# EAGLE design SolarMPPT (EAGLE 9.6.0)
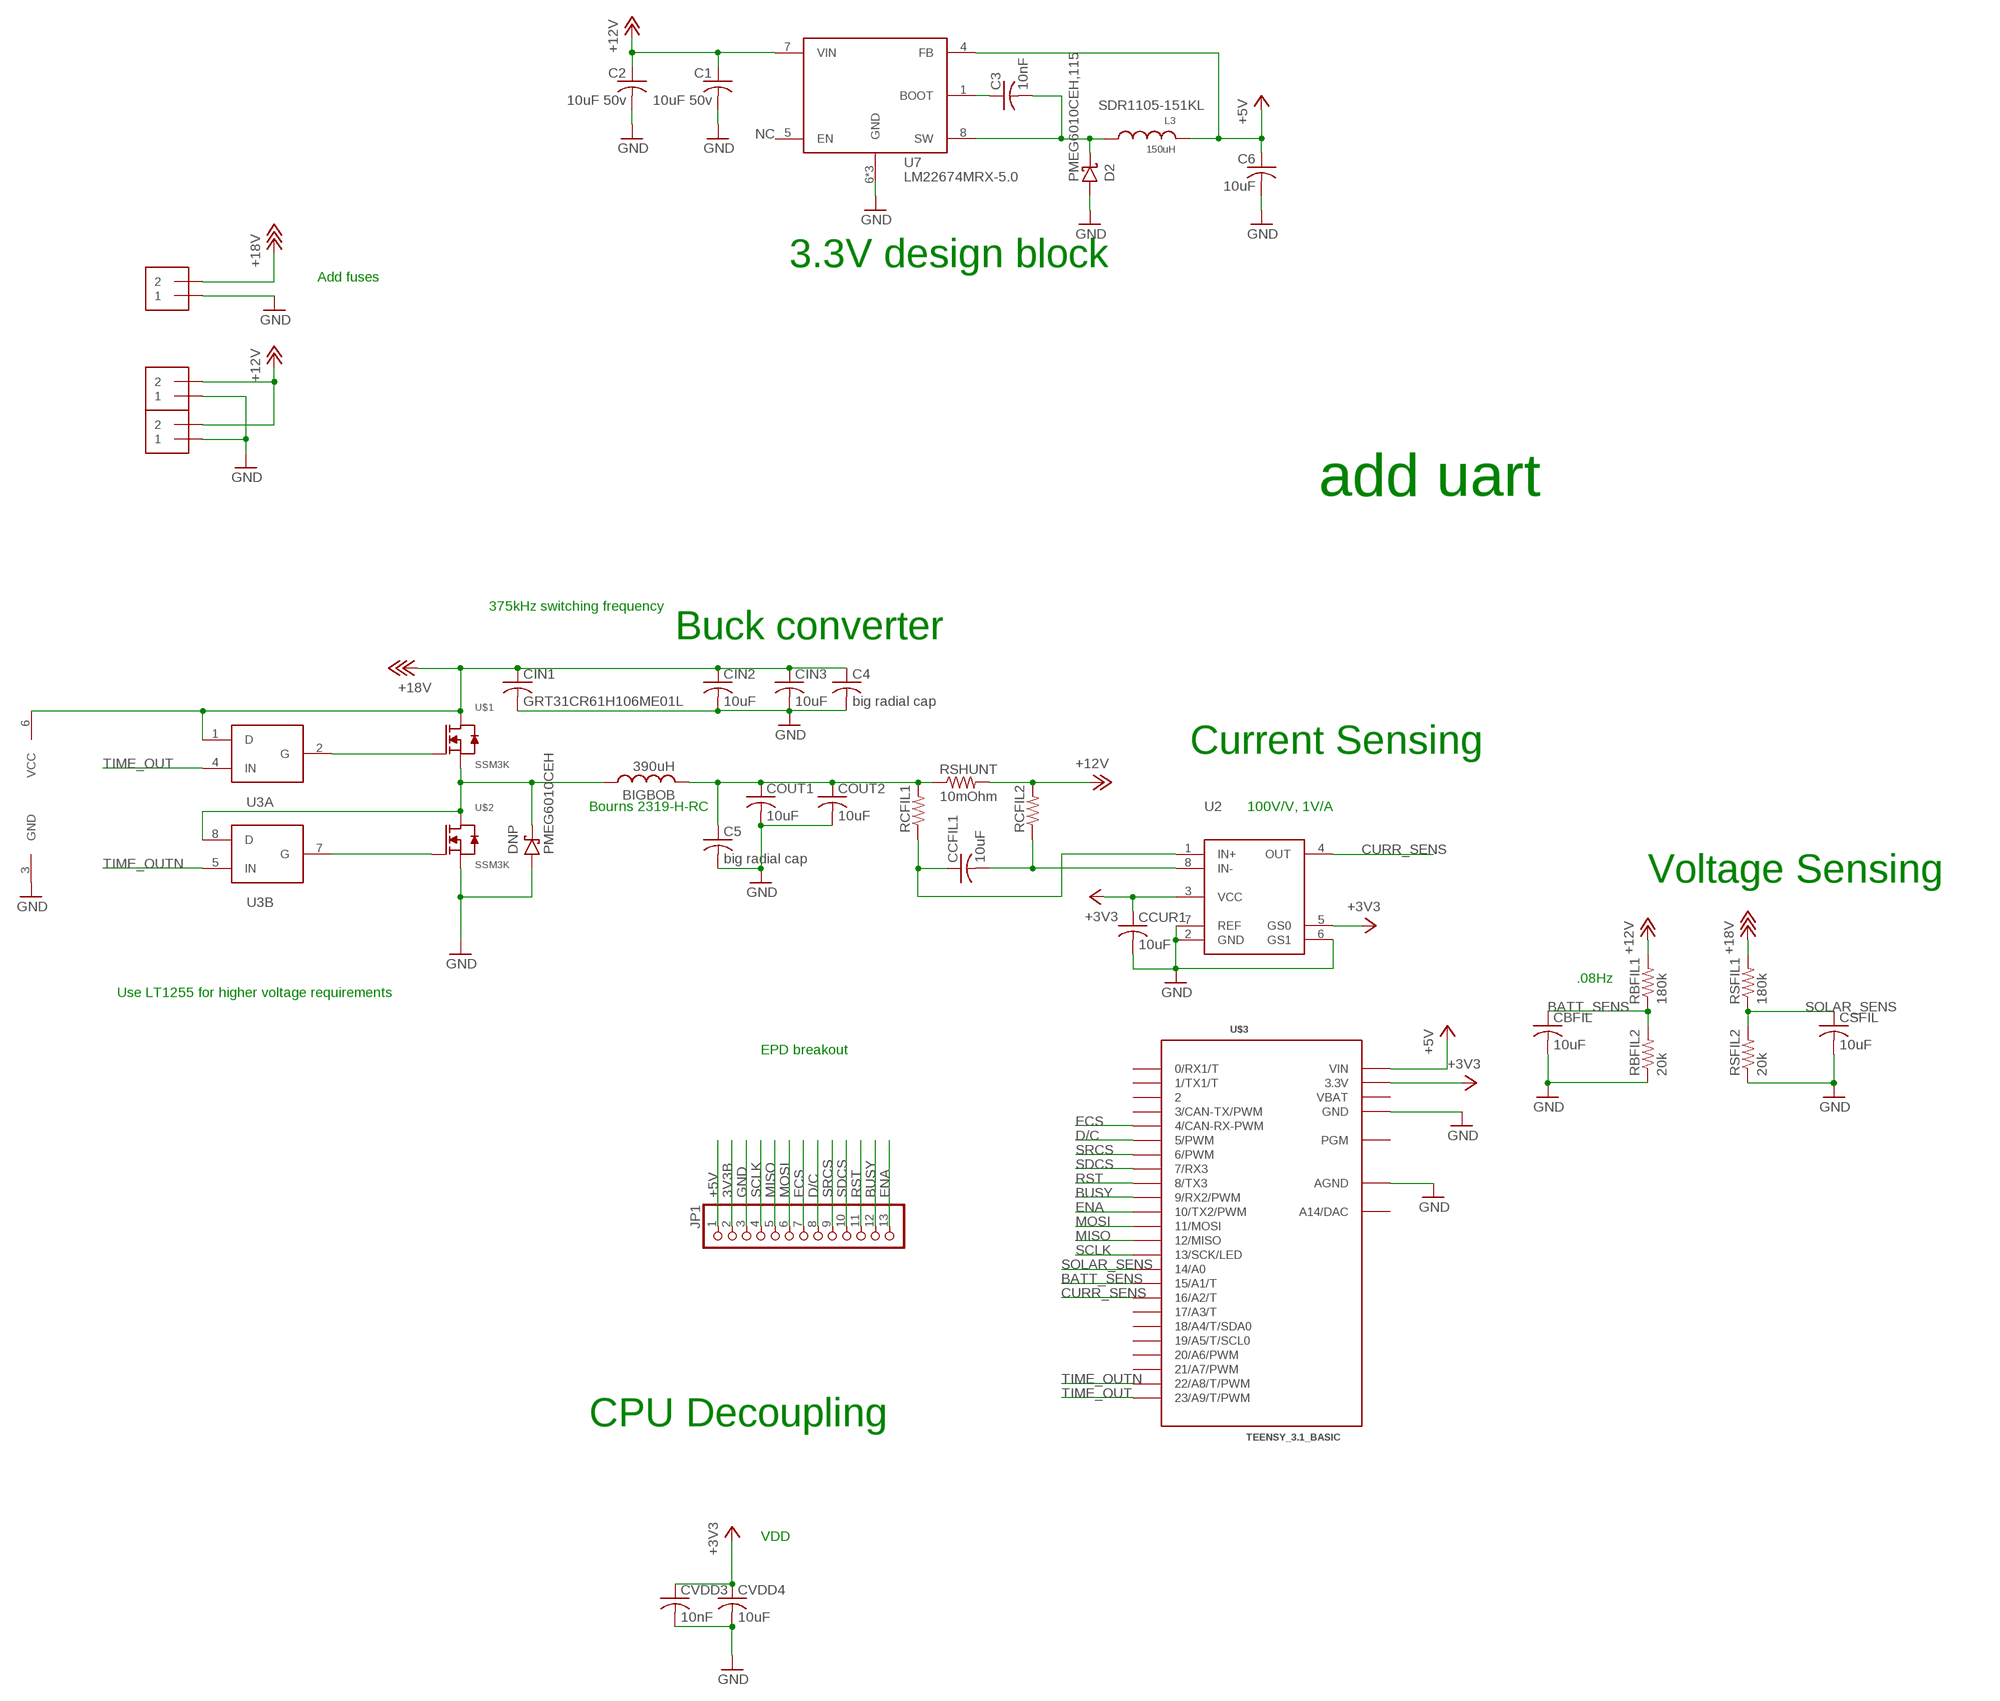
[diagram p0: schematic, sheet 1]

## Parts
BIGBOB  390uH  L-USTJ6-U2  [TJ6-U2]
C1  10uF 50v  C-USC0805  [C0805]
C2  10uF 50v  C-USC1206  [C1206]
C3  10nF  C-USC0805  [C0805]
C4  big radial cap  C-US050-024X044  [C050-024X044]
C5  big radial cap  C-US050-024X044  [C050-024X044]
C6  10uF  C-USC0805  [C0805]
CBFIL  10uF  C-USC0805  [C0805]
CCFIL1  10uF  C-USC0805  [C0805]
CCUR1  10uF  C-USC0805  [C0805]
CIN1  GRT31CR61H106ME01L  C-USC1206  [C1206]
CIN2  10uF  C-USC1206  [C1206]
CIN3  10uF  C-USC1206  [C1206]
COUT1  10uF  C-USC1206  [C1206]
COUT2  10uF  C-USC1206  [C1206]
CSFIL  10uF  C-USC0805  [C0805]
CVDD3  10nF  C-USC0805  [C0805]
CVDD4  10uF  C-USC0805  [C0805]
D2  PMEG6010CEH,115  [SOD-123]
DNP  PMEG6010CEH  MBR0520LT3G  [SOD-123]
J2  1X2-3.5MM  [1X2-3.5MM]
J3  1X2-3.5MM  [1X2-3.5MM]
J6  1X2-3.5MM  [1X2-3.5MM]
JP1  PINHD-1X13  [1X13]
L3  150uH  SDR1105  [SDR1105]
RBFIL1  180k  R-US_R0805  [R0805]
RBFIL2  20k  R-US_R0805  [R0805]
RCFIL1  R-US_R0805  [R0805]
RCFIL2  R-US_R0805  [R0805]
RSFIL1  180k  R-US_R0805  [R0805]
RSFIL2  20k  R-US_R0805  [R0805]
RSHUNT  10mOhm  R-US_R1206  [R1206]
U2  INA225VSSOP  [VSSOP-8]
U3  LTC1155  [LT-SOL8]
U7  LM22674MRX-5.0  LM22674  [SOIC-8-POWERPAD]
U$1  SSM3K  [SOT-23-MOSFET]
U$2  SSM3K  [SOT-23-MOSFET]
U$3  TEENSY_3.1_BASIC  [TEENSY_3.1_BASIC]

## Nets
3V3B: JP1.2
+3V3: CCUR1.1 CVDD3.1 CVDD4.1 U2.3(VCC) U2.5(GS0) U$3.3.3V U$3.3.3V1(3.3V)
+5V: C6.1 JP1.1 L3.P$1 U7.4(FB) U$3.VIN
+12V: C1.1 C2.1 J2.2 J3.2 RBFIL1.2 RCFIL2.2 RSHUNT.2 U7.7(VIN)
+18V: C4.1 CIN1.1 CIN2.1 CIN3.1 J6.2 RSFIL1.2 U3.1(A:D) U3.6(P:VCC) U$1.D
BATT_SENS: CBFIL.1 RBFIL1.1 RBFIL2.2 U$3.15/A1(15/A1/T)
BOOT_5V2: C3.1 U7.1(BOOT)
BUSY: JP1.12 U$3.9(9/RX2/PWM)
CURR_SENS: U2.4(OUT) U$3.16/A2(16/A2/T)
D/C: JP1.8 U$3.5(5/PWM)
ECS: JP1.7 U$3.4(4/CAN-RX-PWM)
ENA: JP1.13 U$3.10(10/TX2/PWM)
GND: C1.2 C2.2 C4.2 C5.2 C6.2 CBFIL.2 CCUR1.2 CIN1.2 CIN2.2 CIN3.2 COUT1.2 COUT2.2 CSFIL.2 CVDD3.2 CVDD4.2 D2.A DNP.A J2.1 J3.1 J6.1 JP1.3 RBFIL2.1 RSFIL2.1 U2.2(GND) U2.6(GS1) U2.7(REF) U3.3(P:GND) U7.6(GND) U7.PAD1(GND) U7.PAD(GND) U$2.S U$3.AGND U$3.GND U$3.GND1(GND)
MISO: JP1.5 U$3.12(12/MISO)
MOSI: JP1.6 U$3.11(11/MOSI)
N$4: U3.2(A:G) U$1.G
N$5: CCFIL1.2 RCFIL2.1 U2.8(IN-)
N$6: CCFIL1.1 RCFIL1.1 U2.1(IN+)
N$7: BIGBOB.1 DNP.K U3.8(B:D) U$1.S U$2.D
N$8: U3.7(B:G) U$2.G
N$10: BIGBOB.2 C5.1 COUT1.1 COUT2.1 RCFIL1.2 RSHUNT.1
RST: JP1.11 U$3.8(8/TX3)
SCLK: JP1.4 U$3.13(13/SCK/LED)
SDCS: JP1.10 U$3.7(7/RX3)
SOLAR_SENS: CSFIL.1 RSFIL1.1 RSFIL2.2 U$3.14/A0
SRCS: JP1.9 U$3.6(6/PWM)
SW_5V2: C3.2 D2.K L3.P$2 U7.8(SW)
TIME_OUT: U3.4(A:IN) U$3.23/A9(23/A9/T/PWM)
TIME_OUTN: U3.5(B:IN) U$3.22/A8(22/A8/T/PWM)
Unconnected: U7.5(EN) U$3.0(0/RX1/T) U$3.1(1/TX1/T) U$3.2 U$3.3(3/CAN-TX/PWM) U$3.17/A3(17/A3/T) U$3.18/A4(18/A4/T/SDA0) U$3.19/A5(19/A5/T/SCL0) U$3.20/A6(20/A6/PWM) U$3.21/A7(21/A7/PWM) U$3.A14(A14/DAC) U$3.PGM

## Notes on the sheet
- SDR1105-151KL
- NC
- 3.3V design block
- Add fuses
- add uart
- 375kHz switching frequency
- Buck converter
- Current Sensing
- Bourns 2319-H-RC | 100V/V, 1V/A
- Voltage Sensing
- .08Hz
- Use LT1255 for higher voltage requirements
- EPD breakout
- CPU Decoupling
- VDD

## Power pins joined to a net without a drawn wire
VBAT: U$3.VBAT

## Library data of the parts
BIGBOB = rcl:L-US: INDUCTOR, American symbol; SPICEPREFIX: L
C1 = rcl:C-US: CAPACITOR, American symbol; PARTNO: UMK212BJ105KG-T
C2 = rcl:C-US: CAPACITOR, American symbol; PARTNO: GRM31CR71H475KA12L
C3 = rcl:C-US: CAPACITOR, American symbol; PARTNO: GRM216R71H103KA01D
C4 C5 CBFIL CCFIL1 CCUR1 CIN1-CIN3 COUT1 COUT2 CSFIL CVDD3 CVDD4 = rcl:C-US: CAPACITOR, American symbol; SPICEPREFIX: C
C6 = rcl:C-US: CAPACITOR, American symbol; PARTNO: GRM21BR61E106KA73L
D2 = FormE:PMEG6010CEH,115; PARTNO: PMEG6010CEH115
DNP = FormE:MBR0520LT3G; VALUE: MBR0520LT3G
J2 J3 J6 = adafruit:1X2: 3.5mm Terminal block http://www.ladyada.net/library/pcb/eaglelibrary.html
JP1 = pinhead:PINHD-1X13: PIN HEADER
L3 = FormE:SDR1105; PARTNO: SDR1105-151KL
RBFIL1 RBFIL2 RCFIL1 RCFIL2 RSFIL1 RSFIL2 RSHUNT = rcl:R-US_: RESISTOR, American symbol; SPICEPREFIX: R
U2 = FormE:INA225: Current Shunt Amplifier Link <http://www.ti.com/lit/ds/symlink/ina225-q1.pdf>
U3 = FormE:LTC1155
U7 = FormE:LM22674; PARTNO: LM22674MRX-5.0/NOPB; VALUE: LM22674
U$1 U$2 = FormE:SSM3K: N channel MOSFET SSM3K329RLFCT-ND
U$3 = FormE:TEENSY_3.1_BASIC: Footprint for Teensy 3.1 board using all pin connections on the outer perimeter

## Board
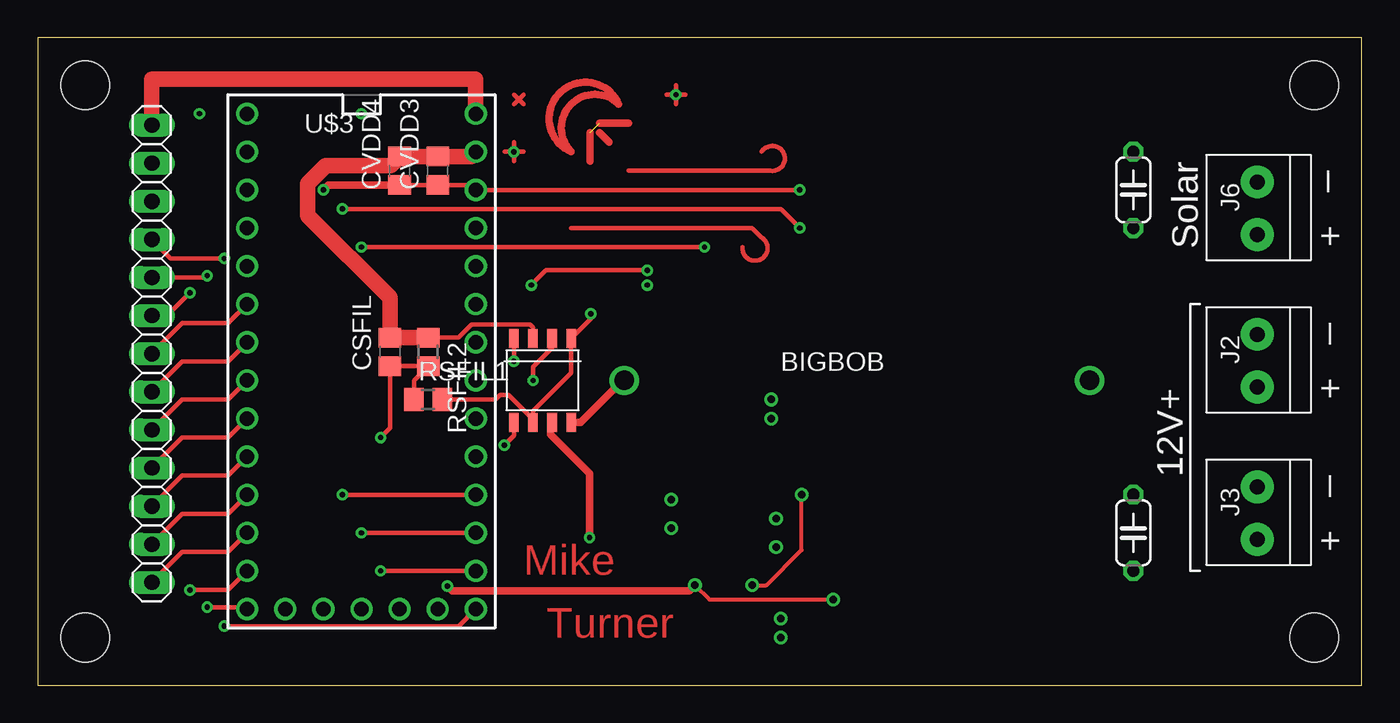
[diagram p1: board, top side]
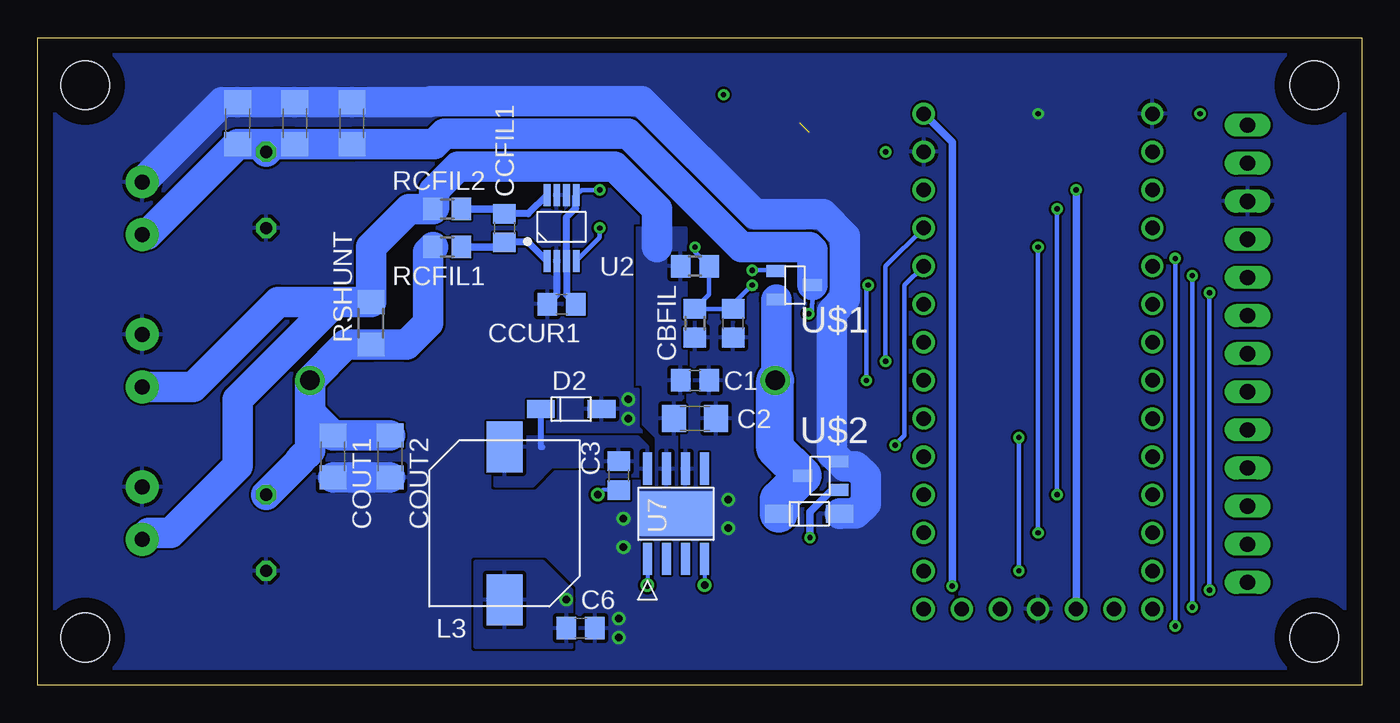
[diagram p2: board, bottom side, seen from below]

Size 88.27 x 43.18 mm. Coordinates in mm from the lower left corner, seen from the top.
Outline: 0,0 88.27,0 88.27,43.18 0,43.18 0,0
Copper layers (1*16): Top 0.035mm / dielectric 1.5mm / Bottom 0.035mm
Design rules "default": minimum track width 6mil, minimum drill 0.35mm, track to track 6mil, track to pad 6mil, pad to pad 6mil, via to via 6mil, smd to smd 6mil, copper to edge 40mil, drill to drill 6mil, minimum pad ring 10mil, minimum via ring 8mil, stop-mask expansion 4mil, vias tented up to drill 0mil, thermal gap 10mil
Holes 3.25 mm at 3.18,3.17 3.18,40.01 85.09,3.17 85.09,40.01

### Footprints (pad centres in the part's own frame; a part is rotated, then mirrored left to right if it is on the bottom)
TJ6-U2 = drill 1.3: 1 -15.5,0; 2 15.5,0
C0805 = smd 1.3 x 1.5: 1 -0.95,0; 2 0.95,0
C1206 = smd 1.6 x 1.8: 1 -1.4,0; 2 1.4,0
C050-024X044 = drill 0.813 octagon: 1 -2.54,0; 2 2.54,0
SOD-123 = smd 1.2 x 1.85: A 0,-2.025; K 0,2.025
1X2-3.5MM = drill 1 pad 2.184: 1 1.8,0; 2 -1.7,0
1X13 = drill 1.016 long: 1 -15.24,0; 2 -12.7,0; 3 -10.16,0; 4 -7.62,0; 5 -5.08,0; 6 -2.54,0; 7 0,0; 8 2.54,0; 9 5.08,0; 10 7.62,0; 11 10.16,0; 12 12.7,0; 13 15.24,0
SDR1105 = smd 2.4 x 3.4: P$1 0,5.1; P$2 0,-5.1
R0805 = smd 1.3 x 1.5: 1 -0.95,0; 2 0.95,0
R1206 = smd 1.6 x 1.803: 1 -1.422,0; 2 1.422,0
VSSOP-8 = smd 0.45 x 1.45: 1 -0.975,-2.2; 2 -0.325,-2.2; 3 0.325,-2.2; 4 0.975,-2.2; 5 0.975,2.2; 6 0.325,2.2; 7 -0.325,2.2; 8 -0.975,2.2
LT-SOL8 = smd 1.27 x 0.635: 1 -2.794,1.905; 2 -2.794,0.635; 3 -2.794,-0.635; 4 -2.794,-1.905; 5 2.794,-1.905; 6 2.794,-0.635; 7 2.794,0.635; 8 2.794,1.905
SOIC-8-POWERPAD = smd 0.6 x 2.15: 1 -1.905,-3; 2 -0.635,-3; 3 0.635,-3; 4 1.905,-3; 5 1.905,3; 6 0.635,3; 7 -0.635,3; 8 -1.905,3 | smd 3.1 x 2.4: PAD 0,0 | smd 4.9 x 2.95: PAD1 0,0
SOT-23-MOSFET = smd 0.8 x 1.3: D 0,1.47; G -0.95,-0.93; S 0.95,-0.93
TEENSY_3.1_BASIC = drill 0.965: 0 -7.62,13.97; 1 -7.62,11.43; 2 -7.62,8.89; 3 -7.62,6.35; 3.3V 7.62,11.43; 3.3V1 -2.54,-16.51; 4 -7.62,3.81; 5 -7.62,1.27; 6 -7.62,-1.27; 7 -7.62,-3.81; 8 -7.62,-6.35; 9 -7.62,-8.89; 10 -7.62,-11.43; 11 -7.62,-13.97; 12 -7.62,-16.51; 13 7.62,-16.51; 14/A0 7.62,-13.97; 15/A1 7.62,-11.43; 16/A2 7.62,-8.89; 17/A3 7.62,-6.35; 18/A4 7.62,-3.81; 19/A5 7.62,-1.27; 20/A6 7.62,1.27; 21/A7 7.62,3.81; 22/A8 7.62,6.35; 23/A9 7.62,8.89; A14 5.08,-16.51; AGND 7.62,13.97; GND -7.62,16.51; GND1 0,-16.51; PGM 2.54,-16.51; VBAT -5.08,-16.51; VIN 7.62,16.51

### Placement (x,y rotation side)
BIGBOB  54.61,20.32 0 top
C1  44.45,20.32 0 bottom
C2  44.45,17.78 0 bottom
C3  49.53,13.97 90 bottom
C4  73.02,33.02 270 top
C5  73.02,10.16 270 top
C6  52.07,3.81 0 bottom
CBFIL  41.91,24.13 270 bottom
CCFIL1  57.15,30.48 90 bottom
CCUR1  53.34,25.4 180 bottom
CIN1  74.93,37.47 90 bottom
CIN2  71.12,37.47 90 bottom
CIN3  67.31,37.47 90 bottom
COUT1  68.58,15.24 270 bottom
COUT2  64.77,15.24 270 bottom
CSFIL  23.5,22.23 90 top
CVDD3  26.67,34.29 90 top
CVDD4  24.13,34.29 90 top
D2  52.7,18.41 90 bottom
DNP  36.83,11.43 90 bottom
J2  81.28,21.59 90 top
J3  81.28,11.43 90 top
J6  81.28,31.75 90 top
JP1  7.62,22.1 270 top
L3  57.15,10.8 180 bottom
RBFIL1  44.45,27.94 180 bottom
RBFIL2  44.45,24.13 90 bottom
RCFIL1  60.96,29.21 180 bottom
RCFIL2  60.96,31.75 180 bottom
RSFIL1  26.04,19.05 0 top
RSFIL2  26.04,22.23 270 top
RSHUNT  66.04,24.13 90 bottom
U2  53.34,30.48 0 bottom
U3  33.66,20.32 270 top
U7  45.72,11.43 0 bottom
U$1  38.1,26.67 270 bottom
U$2  35.81,13.97 90 bottom
U$3  21.59,21.59 0 top

### Tracks (layer width: path | path; a pad name or v marks a point on that pad's centre or on a via)
+3V3  (via drill 0.35)
  Top 0.305: v50.8,33.02 U$3.3.3V 28.89,33.34 CVDD3.1 CVDD4.1
  Top 0.508: CVDD4.1 19.37,33.34 v19.05,33.02
  Bottom 0.305: U2.5 52.03,33.02 v50.8,33.02
  Bottom 0.457: U2.5 52.41,32.64 52.41,31.8 53.02,31.19 U2.3 53.02,26.02 CCUR1.1
  Bottom 0.508: v19.05,33.02 U$3.3.3V1
+5V  (via drill 0.35, 0.5)
  Top 0.254: v43.81,6.67 44.77,5.71 v53.02,5.71
  Top 0.508: v43.81,6.67 43.43,6.29 27.62,6.29 v27.31,6.6
  Top 1.016: U$3.VIN 29.21,40.39 7.62,40.39 JP1.1
  Bottom 0.254: U7.4 v43.81,6.67
  Bottom 0.508: v27.31,6.6 27.31,36.2 U$3.VIN
  pour Bottom (rank 4): 52.7,6.35 52.7,2.54 59.05,2.54 59.05,8.25 54.61,8.25
+12V
  Bottom 2.032: RSHUNT.2 66.04,29.21 63.5,31.75 RCFIL2.2 61.83,31.83 61.83,32.98 60.24,34.57 49.81,34.57 46.99,31.75 46.99,29.21 | RSHUNT.2 68.43,25.55 74.93,19.05 74.93,14.61 79.38,10.16 80.85,10.16 J3.2 | J2.2 77.9,19.89 72.24,25.55 RSHUNT.2
  pour Bottom (rank 3): 45.72,13.34 46.99,13.34 46.99,16.51 48.26,17.78 48.26,30.48 45.08,30.48 45.08,19.37 45.72,18.73
+18V  (via drill 0.35)
  Top 0.305: RSFIL1.2 30.53,19.05 30.83,19.35 31.4,19.35 33.02,17.73 U3.6 33.03,17.54 33.03,18.29 35.56,20.82 U3.1 36.88,24.43 v36.88,24.77
  Bottom 0.305: v36.88,24.77 36.65,24.99 36.65,25.42 36.63,25.45 U$1.D
  Bottom 2.032: CIN2.1 CIN3.1 61.84,36.06 61.14,36.76 48.91,36.76 41.36,29.21 36.83,29.21 36.63,29.01 U$1.D | CIN2.1 CIN1.1 80.94,30.05 J6.2 | C4.1 72.52,36.06 CIN2.1
BATT_SENS  (via drill 0.35)
  Top 0.305: v21.59,10.16 U$3.15/A1 | v44.45,29.21 v21.59,29.21
  Bottom 0.305: v40.64,26.67 41.91,25.4 CBFIL.1 RBFIL2.2 43.5,26.03 RBFIL1.1 44.45,28.89 v44.45,29.21 | v21.59,29.21 v21.59,10.16
BOOT_5V2  (via drill 0.5)
  Top 0.254: v47.62,6.67 48.58,6.67 50.93,9.02 v50.93,12.7
  Bottom 0.254: U7.1 v47.62,6.67 | C3.1 50.61,13.02 v50.93,12.7
BUSY
  Top 0.305: U$3.9 12.7,11.43 9.65,11.43 JP1.12
CURR_SENS  (via drill 0.35)
  Top 0.305: v50.8,30.48 49.53,31.75 v20.32,31.75 | v20.32,12.7 U$3.16/A2
  Bottom 0.305: U2.4 50.8,29.84 v50.8,30.48 | v20.32,31.75 v20.32,12.7
D/C
  Top 0.305: U$3.5 12.7,21.59 9.65,21.59 JP1.8
ECS
  Top 0.305: U$3.4 12.7,24.13 9.65,24.13 JP1.7
ENA
  Top 0.305: U$3.10 12.7,8.89 9.65,8.89 JP1.13
GND  (via drill 0.35, 0.5)
  Top 0.305: U3.3 33.02,23.86 32.83,24.05 28.93,24.05 28.05,23.18 RSFIL2.1
  Top 1.016: U$3.AGND 28.89,35.24 CVDD3.2 CVDD4.2 23.54,34.65 19.21,34.65 18.01,33.45 18.01,31.32 23.5,25.84 CSFIL.2 RSFIL2.1
  Bottom 0.457: U2.2 53.67,26.02 CCUR1.2
  Bottom 2.032: COUT2.2 COUT1.2 | DNP.A 34.78,11.45 33.75,11.45 33.07,12.14 33.07,13.9 33.75,14.59 34.45,14.59 35.33,15.47 35.33,22.86 35.33,24.88 34.45,25.77 34.45,29.91 35.92,31.39 40.46,31.39 48,38.94 62.05,38.94 62.13,38.87 CIN3.2 CIN2.2 CIN1.2 75.97,38.87 J6.1
  other vias: 48.89,19.05 48.89,17.78 49.21,11.11 49.21,9.21 49.53,4.44 49.53,3.17 42.23,12.38 42.23,10.48 21.59,38.1
  pour Bottom (rank 6): 41.28,23.5 62.23,23.5 62.23,2.54 41.28,2.54
  pour Bottom (rank 2): 50.8,19.69 50.8,17.14 48.26,17.14 48.26,19.69
  pour Bottom (rank 5): 0,0 88.27,0 88.27,43.18 0,43.18
MISO  (via drill 0.35)
  Top 0.305: U$3.12 13.84,5.21 v11.3,5.21 | v11.3,27.3 11.18,27.18 JP1.5
  Bottom 0.305: v11.3,27.3 v11.3,5.21
MOSI  (via drill 0.35)
  Top 0.305: U$3.11 12.7,6.35 v10.16,6.35 | v10.16,26.16 8.64,24.64 JP1.6
  Bottom 0.305: v10.16,26.16 v10.16,6.35
N$1
  Top 0.508: 35.56,35.56 arc-224 38.73,38.73 arc180 35.56,35.56
N$2
  Top 0.508: 37.47,36.83 38.1,36.2
N$3  (via drill 0.35)
  Top 0.305: 42.55,40.01 v42.55,39.37 | v42.55,39.37 42.55,38.73 | 41.91,39.37 v42.55,39.37 | v42.55,39.37 43.18,39.37
N$4  (via drill 0.35)
  Top 0.305: v40.64,27.66 33.89,27.66 v32.9,26.67 | v33.02,20.32 33.02,21.21 34.29,22.48 U3.2
  Bottom 0.305: U$1.G 39.07,27.66 v40.64,27.66 | v32.9,26.67 33.02,26.55 v33.02,20.32
N$5
  Bottom 0.457: U2.8 55.56,31.43 CCFIL1.2
  Bottom 0.508: CCFIL1.2 57.47,31.75 RCFIL2.1
N$6
  Bottom 0.457: U2.1 55.56,29.53 CCFIL1.1
  Bottom 0.508: CCFIL1.1 57.47,29.21 RCFIL1.1
N$7
  Top 0.508: U3.8 36.19,17.53 38.99,20.32 BIGBOB.1
  Bottom 2.032: U$1.S 39.03,20.4 BIGBOB.1
  Bottom 2.54: BIGBOB.1 39.11,15.8 U$2.D 38.86,12.4 DNP.K
N$8  (via drill 0.35)
  Top 0.508: U3.7 34.2,17.44 34.2,16.72 36.79,14.14 v36.79,9.84
  Bottom 0.508: U$2.G 35.03,12.87 35.46,12.87 36.79,11.55 v36.79,9.84
N$10
  Bottom 2.032: COUT2.1 COUT1.1 70.11,18.17 BIGBOB.2 | RCFIL1.2 62.23,28.89 62.23,24.13 63.65,22.71 RSHUNT.1 67.72,22.71 BIGBOB.2 | BIGBOB.2 70.11,15.66 70.76,15.01 70.76,14.96 C5.1
N$12  (via drill 0.35)
  Top 0.305: 31.75,34.92 v31.75,35.56 | v31.75,35.56 31.75,36.2 | 32.39,35.56 v31.75,35.56 | v31.75,35.56 31.11,35.56
N$14
  Top 0.305: 31.75,38.73 32.39,39.37
N$15
  Top 0.305: 32.39,38.73 31.75,39.37
N$16
  Top 0.305: 39.37,34.29 48.89,34.29 arc243 48.26,35.56
N$17  (via drill 0.35)
  other vias: 10.8,38.1
N$18
  Top 0.305: 35.56,30.48 47.62,30.48 48.26,29.84 arc-243 46.99,29.21
N$69  (1 unrouted)
  Top 0.508: 36.83,36.83 36.83,34.92 | 37.47,37.47 39.37,37.47
RST
  Top 0.305: U$3.8 12.7,13.97 9.65,13.97 JP1.11
SCLK  (via drill 0.35)
  Top 0.305: v12.45,3.94 28.07,3.94 U$3.13 | v12.45,28.45 8.89,28.45 JP1.4
  Bottom 0.305: v12.45,28.45 v12.45,3.94
SDCS
  Top 0.305: U$3.7 12.7,16.51 9.65,16.51 JP1.10
SOLAR_SENS  (via drill 0.35)
  Top 0.305: v22.86,7.62 U$3.14/A0 | v22.86,16.51 23.5,17.14 CSFIL.1 RSFIL2.2 25.09,20.32 RSFIL1.1
  Bottom 0.305: v22.86,16.51 v22.86,7.62
SRCS
  Top 0.305: U$3.6 12.7,19.05 9.65,19.05 JP1.9
SW_5V2
  Bottom 0.406: D2.K 54.73,15.88 54.61,15.88
  pour Bottom (rank 4): 47.62,13.97 47.62,15.88 48.26,16.51 57.78,16.51 57.78,13.34 55.25,13.34 53.97,14.61 49.53,14.61 48.89,13.97
TIME_OUT  (via drill 0.35)
  Top 0.305: U3.4 v31.75,21.59
  Bottom 0.305: v31.75,21.59 31.75,27.94 U$3.23/A9
TIME_OUTN  (via drill 0.35)
  Top 0.305: U3.5 31.75,16.64 v31.11,16
  Bottom 0.305: v31.11,16 30.48,16.64 30.48,26.67 U$3.22/A8

### Text on the board
Top: Mike | Turner
tPlace: Solar | _ | + | _ | 12V+ | + | _ | +